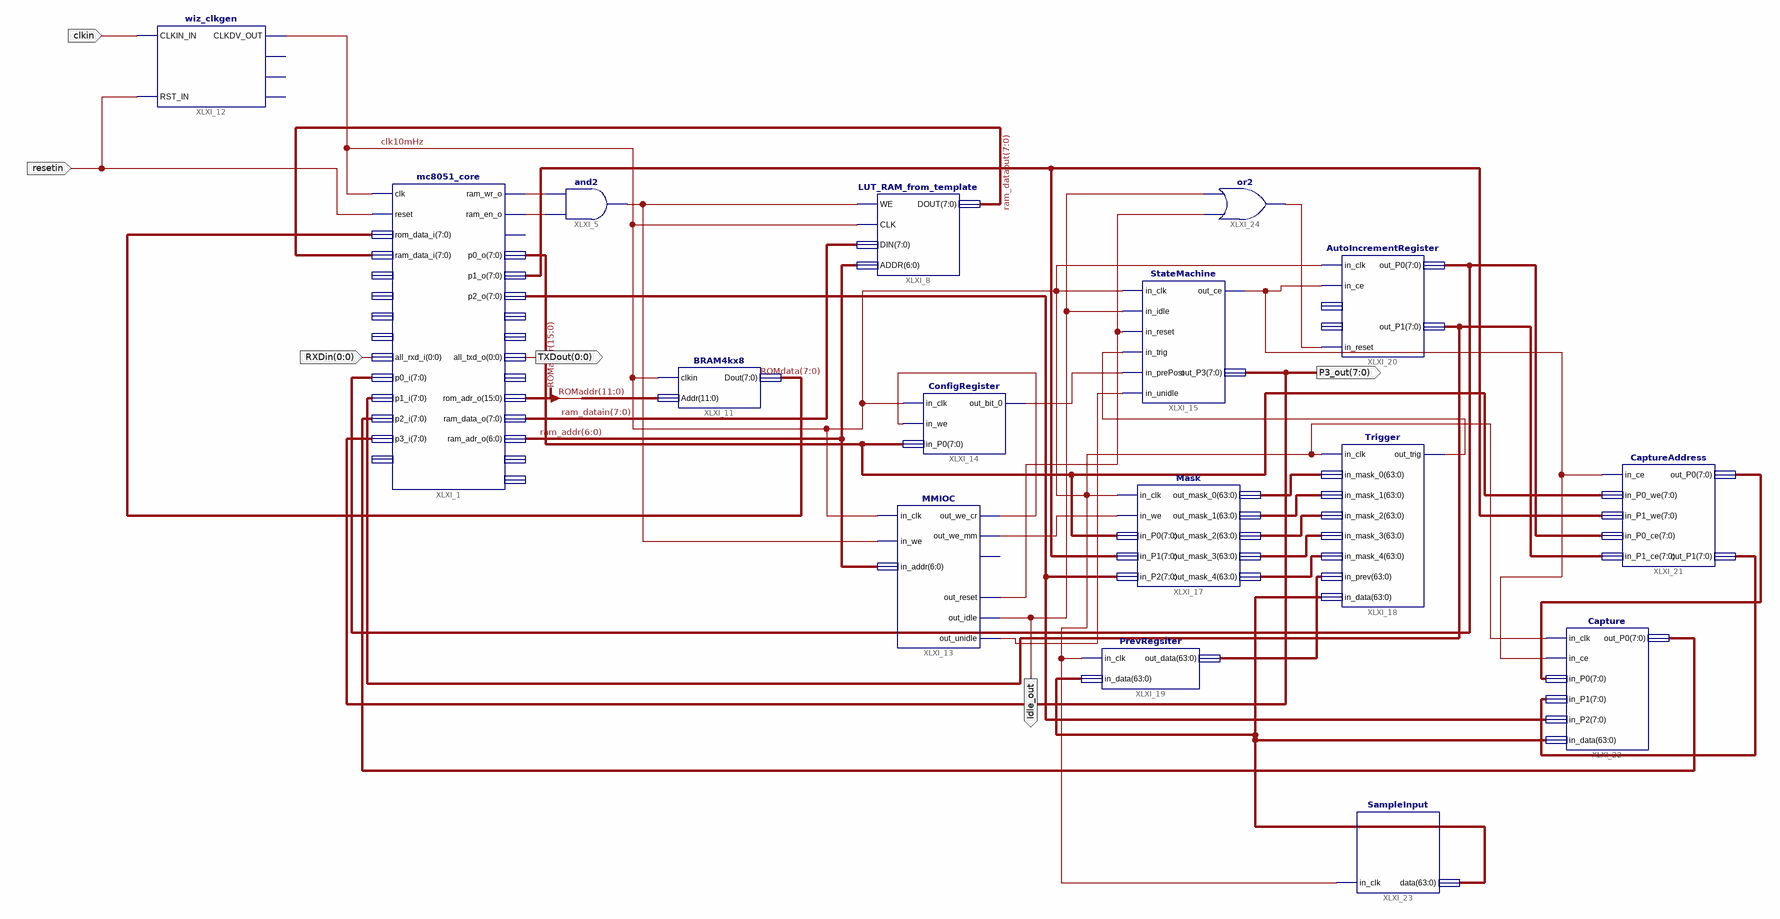
[diagram p0: schematic sheet 1]
// Xilinx ISE schematic top.sch (spartan3e) as structural Verilog: 16 symbols, 6 ports
module top (
  input  resetin,
  input  clkin,
  input  [0:0] RXDin,
  output Idle_out,
  output [7:0] P3_out,
  output [0:0] TXDout
);

  wire clk10mHz, XLXN_9, XLXN_10, XLXN_17, XLXN_19, XLXN_24, XLXN_26, XLXN_39, XLXN_71, XLXN_76, XLXN_77,
       XLXN_83;
  wire [6:0] ram_addr;
  wire [7:0] ram_datain, ram_dataout, ROMdata, XLXN_20, XLXN_46, XLXN_47, XLXN_48, XLXN_49, XLXN_73, XLXN_84,
       XLXN_85;
  wire [15:0] ROMaddr;
  wire [63:0] XLXN_29, XLXN_30, XLXN_31, XLXN_32, XLXN_33, XLXN_37, XLXN_53;

  mc8051_core XLXI_1 (
    .clk(clk10mHz), .reset(resetin), .rom_data_i(ROMdata), .ram_data_i(ram_dataout), .all_rxd_i(RXDin[0]),
    .p0_i(XLXN_84), .p1_i(XLXN_85), .p2_i(XLXN_46), .p3_i(P3_out), .ram_wr_o(XLXN_9), .ram_en_o(XLXN_10),
    .p0_o(XLXN_20), .p1_o(XLXN_73), .p2_o(XLXN_49), .all_txd_o(TXDout[0]), .rom_adr_o(ROMaddr),
    .ram_data_o(ram_datain), .ram_adr_o(ram_addr));  // open: int0_i, int1_i, all_t0_i, all_t1_i, datax_i, wrx_o, p3_o, all_rxd_o, all_rxdwr_o, datax_o, adrx_o
  and XLXI_5 (XLXN_17, XLXN_10, XLXN_9);
  LUT_RAM_from_template XLXI_8 (.WE(XLXN_17), .CLK(clk10mHz), .DIN(ram_datain), .ADDR(ram_addr), .DOUT(ram_dataout));
  BRAM4kx8 XLXI_11 (.clkin(clk10mHz), .Addr(ROMaddr[11:0]), .Dout(ROMdata));
  wiz_clkgen XLXI_12 (
    .CLKIN_IN(clkin), .RST_IN(resetin), .CLKDV_OUT(clk10mHz));  // open: CLKIN_IBUFG_OUT, CLK0_OUT, LOCKED_OUT
  MMIOC XLXI_13 (
    .in_clk(clk10mHz), .in_we(XLXN_17), .in_addr(ram_addr), .out_we_cr(XLXN_19), .out_we_mm(XLXN_26),
    .out_reset(XLXN_77), .out_idle(Idle_out), .out_unidle(XLXN_71));  // open: out_we_ca
  ConfigRegister XLXI_14 (.in_clk(clk10mHz), .in_we(XLXN_19), .in_P0(XLXN_20), .out_bit_0(XLXN_24));
  StateMachine XLXI_15 (
    .in_clk(clk10mHz), .in_idle(Idle_out), .in_reset(XLXN_77), .in_trig(XLXN_39), .in_prePost(XLXN_24),
    .out_ce(XLXN_76), .out_P3(P3_out), .in_unidle(XLXN_71));
  Mask XLXI_17 (
    .in_clk(clk10mHz), .in_we(XLXN_26), .in_P0(XLXN_20), .in_P1(XLXN_73), .in_P2(XLXN_49),
    .out_mask_0(XLXN_29), .out_mask_1(XLXN_30), .out_mask_2(XLXN_31), .out_mask_3(XLXN_32),
    .out_mask_4(XLXN_33));
  Trigger XLXI_18 (
    .in_clk(clk10mHz), .in_mask_0(XLXN_29), .in_mask_1(XLXN_30), .in_mask_2(XLXN_31), .in_mask_3(XLXN_32),
    .in_mask_4(XLXN_33), .in_prev(XLXN_37), .in_data(XLXN_53), .out_trig(XLXN_39));
  PrevRegsiter XLXI_19 (.in_clk(clk10mHz), .in_data(XLXN_53), .out_data(XLXN_37));
  CaptureAddress XLXI_21 (
    .in_ce(XLXN_76), .in_P0_we(XLXN_20), .in_P1_we(XLXN_73), .in_P0_ce(XLXN_84), .in_P1_ce(XLXN_85),
    .out_P0(XLXN_47), .out_P1(XLXN_48));
  Capture XLXI_22 (
    .in_clk(clk10mHz), .in_ce(XLXN_76), .in_P0(XLXN_47), .in_P1(XLXN_48), .in_P2(XLXN_49), .in_data(XLXN_53),
    .out_P0(XLXN_46));
  SampleInput XLXI_23 (.in_clk(clk10mHz), .data(XLXN_53));
  AutoIncrementRegister XLXI_20 (
    .in_clk(clk10mHz), .in_ce(XLXN_76), .out_P0(XLXN_84), .out_P1(XLXN_85), .in_reset(XLXN_83));  // open: in_P0, in_P1
  or XLXI_24 (XLXN_83, XLXN_77, Idle_out);
endmodule
